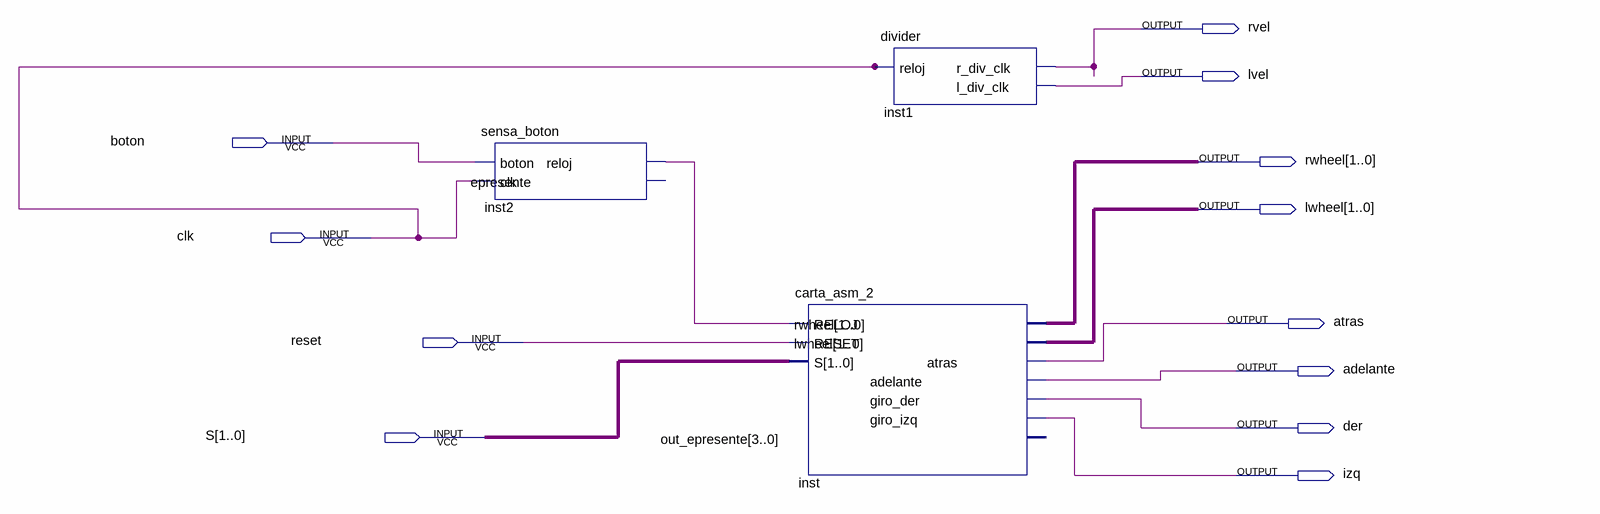
[diagram p0: schematic sheet]
// Quartus schematic proy.bdf as structural Verilog: 3 symbols, 12 pins
module proy (
  input  boton,
  input  clk,
  input  reset,
  input  [1:0] S,
  output rvel,
  output lvel,
  output [1:0] rwheel,
  output [1:0] lwheel,
  output atras,
  output adelante,
  output der,
  output izq
);

  wire inst2_reloj;

  sensa_boton inst2 (.boton(boton), .clk(clk), .reloj(inst2_reloj));  // open: epresente
  carta_asm_2 inst (
    .RELOJ(inst2_reloj), .RESET(reset), .S(S), .rwheel(rwheel), .lwheel(lwheel), .atras(atras),
    .adelante(adelante), .giro_der(der), .giro_izq(izq));  // open: out_epresente
  divider inst1 (.reloj(clk), .r_div_clk(rvel), .l_div_clk(lvel));
endmodule
